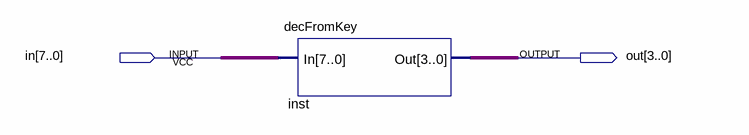
[diagram p0: schematic sheet]
// Quartus schematic test_decfromkey.bdf as structural Verilog: 1 symbols, 2 pins
module test_decfromkey (
  input  [7:0] in,
  output [3:0] out
);

  decFromKey inst (.In(in), .Out(out));
endmodule
